# Altium schematic sheet quadcopter.SchDoc
size A3
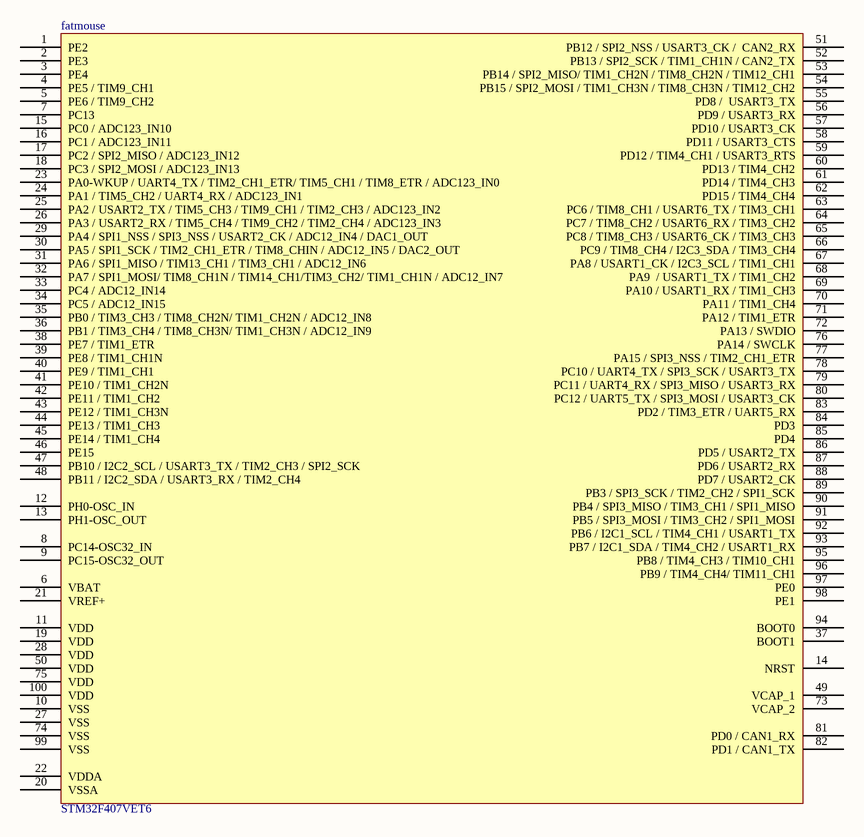
[diagram p0: quadcopter.SchDoc]

## Parts
fatmouse  STM32F407VET6  [LQFP-100]

## Nets

Not connected (* = marked no-connect by the designer): fatmouse 1(PE2) 2(PE3) 3(PE4) 4(PE5_/_TIM9_CH1) 5(PE6_/_TIM9_CH2) 6(VBAT) 7(PC13) 8(PC14-OSC32_IN) 9(PC15-OSC32_OUT) 10(VSS) 11(VDD) 12(PH0-OSC_IN) 13(PH1-OSC_OUT) 14(NRST) 15(PC0_/_ADC123_IN10) 16(PC1_/_ADC123_IN11) 17(PC2_/_SPI2_MISO_/_ADC123_IN12) 18(PC3_/_SPI2_MOSI_/_ADC123_IN13) 19(VDD) 20(VSSA) 21(VREF+) 22(VDDA) 23(PA0-WKUP_/_UART4_TX_/_TIM2_CH1_ETR/_TIM5_CH1_/_TIM8_ETR_/_ADC123_IN0) 24(PA1_/_TIM5_CH2_/_UART4_RX_/_ADC123_IN1) 25(PA2_/_USART2_TX_/_TIM5_CH3_/_TIM9_CH1_/_TIM2_CH3_/_ADC123_IN2) 26(PA3_/_USART2_RX_/_TIM5_CH4_/_TIM9_CH2_/_TIM2_CH4_/_ADC123_IN3) 27(VSS) 28(VDD) 29(PA4_/_SPI1_NSS_/_SPI3_NSS_/_USART2_CK_/_ADC12_IN4_/_DAC1_OUT) 30(PA5_/_SPI1_SCK_/_TIM2_CH1_ETR_/_TIM8_CHIN_/_ADC12_IN5_/_DAC2_OUT) 31(PA6_/_SPI1_MISO_/_TIM13_CH1_/_TIM3_CH1_/_ADC12_IN6) 32(PA7_/_SPI1_MOSI/_TIM8_CH1N_/_TIM14_CH1/TIM3_CH2/_TIM1_CH1N_/_ADC12_IN7) 33(PC4_/_ADC12_IN14) 34(PC5_/_ADC12_IN15) 35(PB0_/_TIM3_CH3_/_TIM8_CH2N/_TIM1_CH2N_/_ADC12_IN8) 36(PB1_/_TIM3_CH4_/_TIM8_CH3N/_TIM1_CH3N_/_ADC12_IN9) 37(BOOT1) 38(PE7_/_TIM1_ETR) 39(PE8_/_TIM1_CH1N) 40(PE9_/_TIM1_CH1) 41(PE10_/_TIM1_CH2N) 42(PE11_/_TIM1_CH2) 43(PE12_/_TIM1_CH3N) 44(PE13_/_TIM1_CH3) 45(PE14_/_TIM1_CH4) 46(PE15) 47(PB10_/_I2C2_SCL_/_USART3_TX_/_TIM2_CH3_/_SPI2_SCK) 48(PB11_/_I2C2_SDA_/_USART3_RX_/_TIM2_CH4) 49(VCAP_1) 50(VDD) 51(PB12_/_SPI2_NSS_/_USART3_CK_/__CAN2_RX) 52(PB13_/_SPI2_SCK_/_TIM1_CH1N_/_CAN2_TX) 53(PB14_/_SPI2_MISO/_TIM1_CH2N_/_TIM8_CH2N_/_TIM12_CH1) 54(PB15_/_SPI2_MOSI_/_TIM1_CH3N_/_TIM8_CH3N_/_TIM12_CH2) 55(PD8_/__USART3_TX) 56(PD9_/_USART3_RX) 57(PD10_/_USART3_CK) 58(PD11_/_USART3_CTS) 59(PD12_/_TIM4_CH1_/_USART3_RTS) 60(PD13_/_TIM4_CH2) 61(PD14_/_TIM4_CH3) 62(PD15_/_TIM4_CH4) 63(PC6_/_TIM8_CH1_/_USART6_TX_/_TIM3_CH1) 64(PC7_/_TIM8_CH2_/_USART6_RX_/_TIM3_CH2) 65(PC8_/_TIM8_CH3_/_USART6_CK_/_TIM3_CH3) 66(PC9_/_TIM8_CH4_/_I2C3_SDA_/_TIM3_CH4) 67(PA8_/_USART1_CK_/_I2C3_SCL_/_TIM1_CH1) 68(PA9__/_USART1_TX_/_TIM1_CH2) 69(PA10_/_USART1_RX_/_TIM1_CH3) 70(PA11_/_TIM1_CH4) 71(PA12_/_TIM1_ETR) 72(PA13_/_SWDIO) 73(VCAP_2) 74(VSS) 75(VDD) 76(PA14_/_SWCLK) 77(PA15_/_SPI3_NSS_/_TIM2_CH1_ETR) 78(PC10_/_UART4_TX_/_SPI3_SCK_/_USART3_TX) 79(PC11_/_UART4_RX_/_SPI3_MISO_/_USART3_RX) 80(PC12_/_UART5_TX_/_SPI3_MOSI_/_USART3_CK) 81(PD0_/_CAN1_RX) 82(PD1_/_CAN1_TX) 83(PD2_/_TIM3_ETR_/_UART5_RX) 84(PD3) 85(PD4) 86(PD5_/_USART2_TX) 87(PD6_/_USART2_RX) 88(PD7_/_USART2_CK) 89(PB3_/_SPI3_SCK_/_TIM2_CH2_/_SPI1_SCK) 90(PB4_/_SPI3_MISO_/_TIM3_CH1_/_SPI1_MISO) 91(PB5_/_SPI3_MOSI_/_TIM3_CH2_/_SPI1_MOSI) 92(PB6_/_I2C1_SCL_/_TIM4_CH1_/_USART1_TX) 93(PB7_/_I2C1_SDA_/_TIM4_CH2_/_USART1_RX) 94(BOOT0) 95(PB8_/_TIM4_CH3_/_TIM10_CH1) 96(PB9_/_TIM4_CH4/_TIM11_CH1) 97(PE0) 98(PE1) 99(VSS) 100(VDD)